# EAGLE design CICERONE AirLink (EAGLE 9.7.0)
COMPANY: https://github.com/atari-researchlab/cicerone-airlink; COPYRIGHT: Copyright (C) 2025 ATARI Research Lab; LICENSE: CERN-OHL-S-2.0+; PROJECT_NAME: CICERONE Airlink
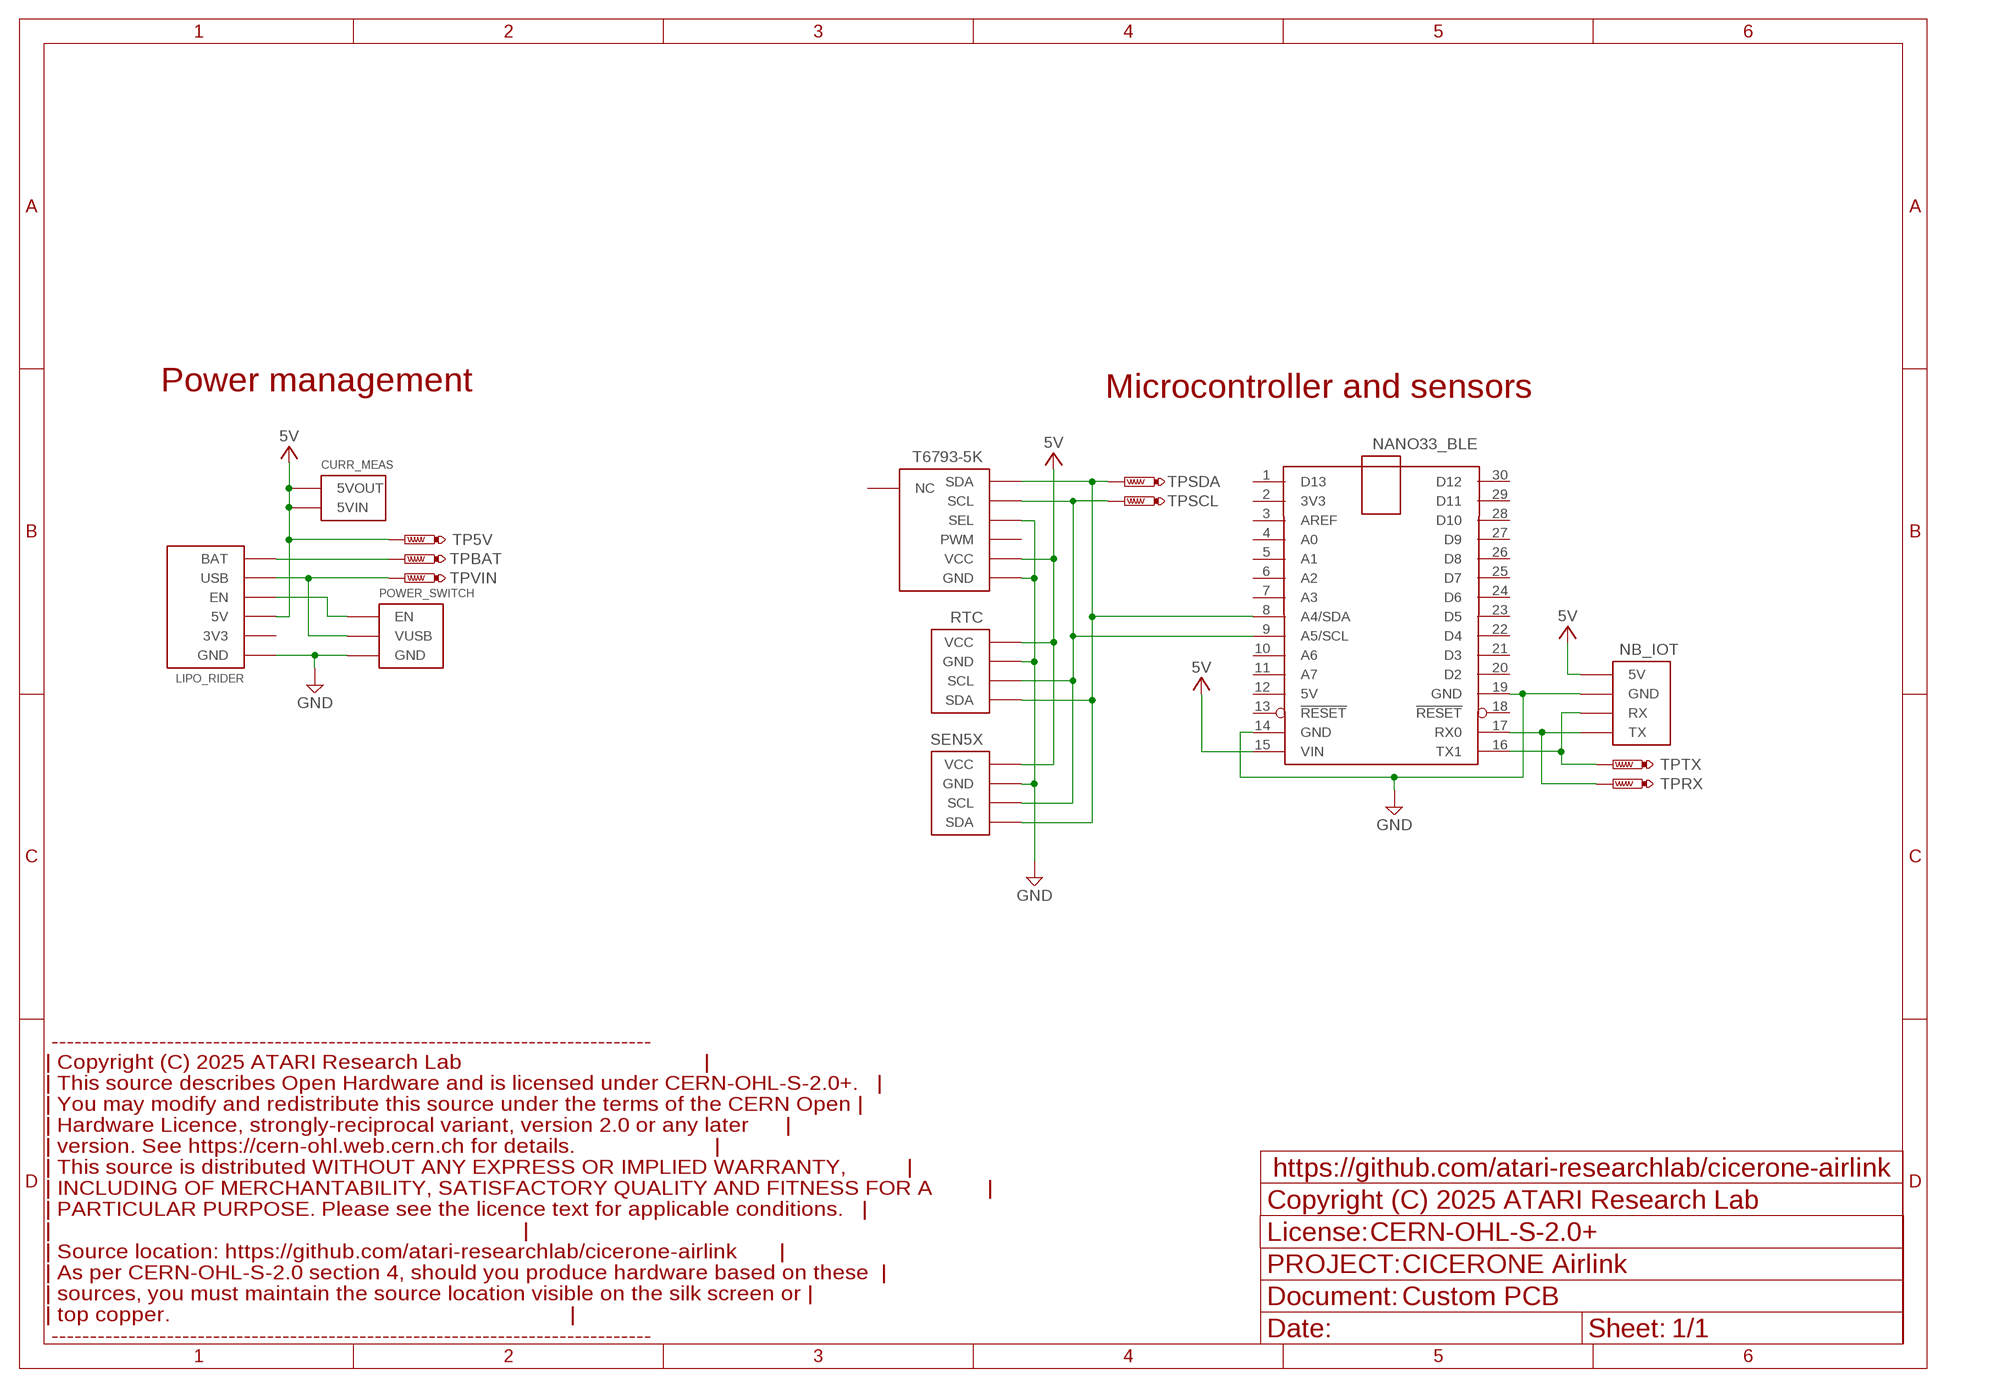
[diagram p0: schematic, sheet 1]

## Parts
CURR_MEAS  I→  CURR-MEAS  [PIN2X1]
LIPO_RIDER  LIPO-RIDER  [LIPO-RIDER-STAND]
NANO33_BLE  NANO33_BLEPIN  [NANO_BLE33_PIN]
NB_IOT  GROVE-UARTSMD  [GROVE_SMD]
POWER_SWITCH  USB_SWITCH  [USB-SWITCH]
RTC  MODULO_RTC  RTC-DS3231MMOD-90  [DS3231M-MOD-90]
SEN5X  I2C-HEADER  [I2C-HEADER]
T6793-5K  T6793  [T6793]
TP5V  PTR1TP20SQ  [TP20SQ]
TPBAT  PTR1TP20SQ  [TP20SQ]
TPRX  PTR1TP20SQ  [TP20SQ]
TPSCL  PTR1TP20SQ  [TP20SQ]
TPSDA  PTR1TP20SQ  [TP20SQ]
TPTX  PTR1TP20SQ  [TP20SQ]
TPVIN  PTR1TP20SQ  [TP20SQ]

## Nets
5V [PWR]: CURR_MEAS.P$1(5VOUT) CURR_MEAS.P$2(5VIN) LIPO_RIDER.P$4(5V) NANO33_BLE.15(VIN) NB_IOT.ROJ(5V) RTC.P$1(VCC) SEN5X.VCC T6793-5K.P$3(VCC) TP5V.TP
EN: LIPO_RIDER.P$2(EN) POWER_SWITCH.P$4(EN)
GND [GND]: LIPO_RIDER.P$3(GND) LIPO_RIDER.P$5(GND) LIPO_RIDER.P$7(GND) NANO33_BLE.14(GND) NANO33_BLE.19(GND) NB_IOT.NEG(GND) NB_IOT.P$1(GND) NB_IOT.P$2(GND) POWER_SWITCH.P$1(GND) RTC.P$2(GND) SEN5X.GND T6793-5K.P$4(GND) T6793-5K.P$6(SEL)
RX_ARDU: NANO33_BLE.17(RX0) NB_IOT.BLA(TX) TPRX.TP
SCL: NANO33_BLE.9(A5/SCL) RTC.P$3(SCL) SEN5X.SCL T6793-5K.P$2(SCL) TPSCL.TP
SDA: NANO33_BLE.8(A4/SDA) RTC.P$4(SDA) SEN5X.SDA T6793-5K.P$1(SDA) TPSDA.TP
TX_ARDU: NANO33_BLE.16(TX1) NB_IOT.AMA(RX) TPTX.TP
VBAT: LIPO_RIDER.P$6(BAT) TPBAT.TP
VUSB [PWR]: LIPO_RIDER.P$8(USB) POWER_SWITCH.P$2(VUSB) POWER_SWITCH.P$3(VUSB) TPVIN.TP
Unconnected: LIPO_RIDER.P$1(3V3) NANO33_BLE.1(D13) NANO33_BLE.2(3V3) NANO33_BLE.3(AREF) NANO33_BLE.4(A0) NANO33_BLE.5(A1) NANO33_BLE.6(A2) NANO33_BLE.7(A3) NANO33_BLE.10(A6) NANO33_BLE.11(A7) NANO33_BLE.12(5V) NANO33_BLE.13(!RESET) NANO33_BLE.18(!RESET) NANO33_BLE.20(D2) NANO33_BLE.21(D3) NANO33_BLE.22(D4) NANO33_BLE.23(D5) NANO33_BLE.24(D6) NANO33_BLE.25(D7) NANO33_BLE.26(D8) NANO33_BLE.27(D9) NANO33_BLE.28(D10) NANO33_BLE.29(D11) NANO33_BLE.30(D12) T6793-5K.P$5(PWM) T6793-5K.P$7(NC)

## Notes on the sheet
- Power management | Microcontroller and sensors
- ------------------------------------------------------------------------------
  | Copyright (C) 2025 ATARI Research Lab                                        |
  | This source describes Open Hardware and is licensed under CERN-OHL-S-2.0+.   |
  | You may modify and redistribute this source under the terms of the CERN Open |
  | Hardware Licence, strongly-reciprocal variant, version 2.0 or any later      |
  | version. See https://cern-ohl.web.cern.ch for details.                       |
  | This source is distributed WITHOUT ANY EXPRESS OR IMPLIED WARRANTY,          |
  | INCLUDING OF MERCHANTABILITY, SATISFACTORY QUALITY AND FITNESS FOR A         |
  | PARTICULAR PURPOSE. Please see the licence text for applicable conditions.   |
  |                                                                              |
  | Source location: https://github.com/atari-researchlab/cicerone-airlink       |
  | As per CERN-OHL-S-2.0 section 4, should you produce hardware based on these  |
  | sources, you must maintain the source location visible on the silk screen or |
  | top copper.                                                                  |
   ------------------------------------------------------------------------------

## Library data of the parts
CURR_MEAS = Custom Cicerone:CURR-MEAS
LIPO_RIDER = Custom Cicerone:LIPO-RIDER
NANO33_BLE = ArduinoNano:NANO33_BLE: Arduino Nano V3.0 Overview: The Arduino Nano is a small, complete, and breadboard-friendly board based on the ATmega328 (Arduino Nano 3.x) or ATmega168 (Arduino Nano 2.x). It has more or less the same functionality of the Arduino Duemilanove, but in a different package. It lacks only a DC power jack, and works with a Mini-B USB cable instead of a standard one. The Nano was designed and is being produced by Gravitech. Specifications: Microcontroller Atmel ATmega168 or ATmega328 Operating Voltage (logic level) 5 V Input Voltage (recommended) 7-12 V Input Voltage (limits) 6-20 V Digital I/O Pins 14 (of which 6 provide PWM output) Analog Input Pins 8 DC Current per I/O Pin 40 mA Flash Memory 16 KB (ATmega168) or 32 KB (ATmega328) of which 2 KB used by bootloader SRAM 1 KB (ATmega168) or 2 KB (ATmega328) EEPROM 512 bytes (ATmega168) or 1 KB (ATmega328) Clock Speed 16 MHz Dimensions 0.73" x 1.70" Length 45 mm Width 18 mm Weigth 5 g Power: The Arduino Nano can be powered via the Mini-B USB connection, 6-20V unregulated external power supply (pin 30), or 5V regulated external power supply (pin 27). The power source is automatically selected to the highest voltage source. Memory: The ATmega168 has 16 KB of flash memory for storing code (of which 2 KB is used for the bootloader); the ATmega328 has 32 KB, (also with 2 KB used for the bootloader). The ATmega168 has 1 KB of SRAM and 512 bytes of EEPROM (which can be read and written with the EEPROM library); the ATmega328 has 2 KB of SRAM and 1 KB of EEPROM. Input and Output: Each of the 14 digital pins on the Nano can be used as an input or output, using pinMode(), digitalWrite(), and digitalRead() functions. They operate at 5 volts. Each pin can provide or receive a maximum of 40 mA and has an internal pull-up resistor (disconnected by default) of 20-50 kOhms. In addition, some pins have specialized functions. Visit Arduino - ArduinoBoardNano <https://www.arduino.cc/en/Main/ArduinoBoardNano>
NB_IOT = Custom Cicerone:GROVE-UART
POWER_SWITCH = Custom Cicerone:USB_SWITCH
RTC = Custom Cicerone:RTC-DS3231M
SEN5X = Custom Cicerone:I2C-HEADER
T6793-5K = Custom Cicerone:T6793
TP5V TPBAT TPRX TPSCL TPSDA TPTX TPVIN = testpad:PTR1: TEST PIN

## Net classes
0 default: width 1 mm
1 PWR: width 1.5 mm
2 GND: width 1 mm

## Board
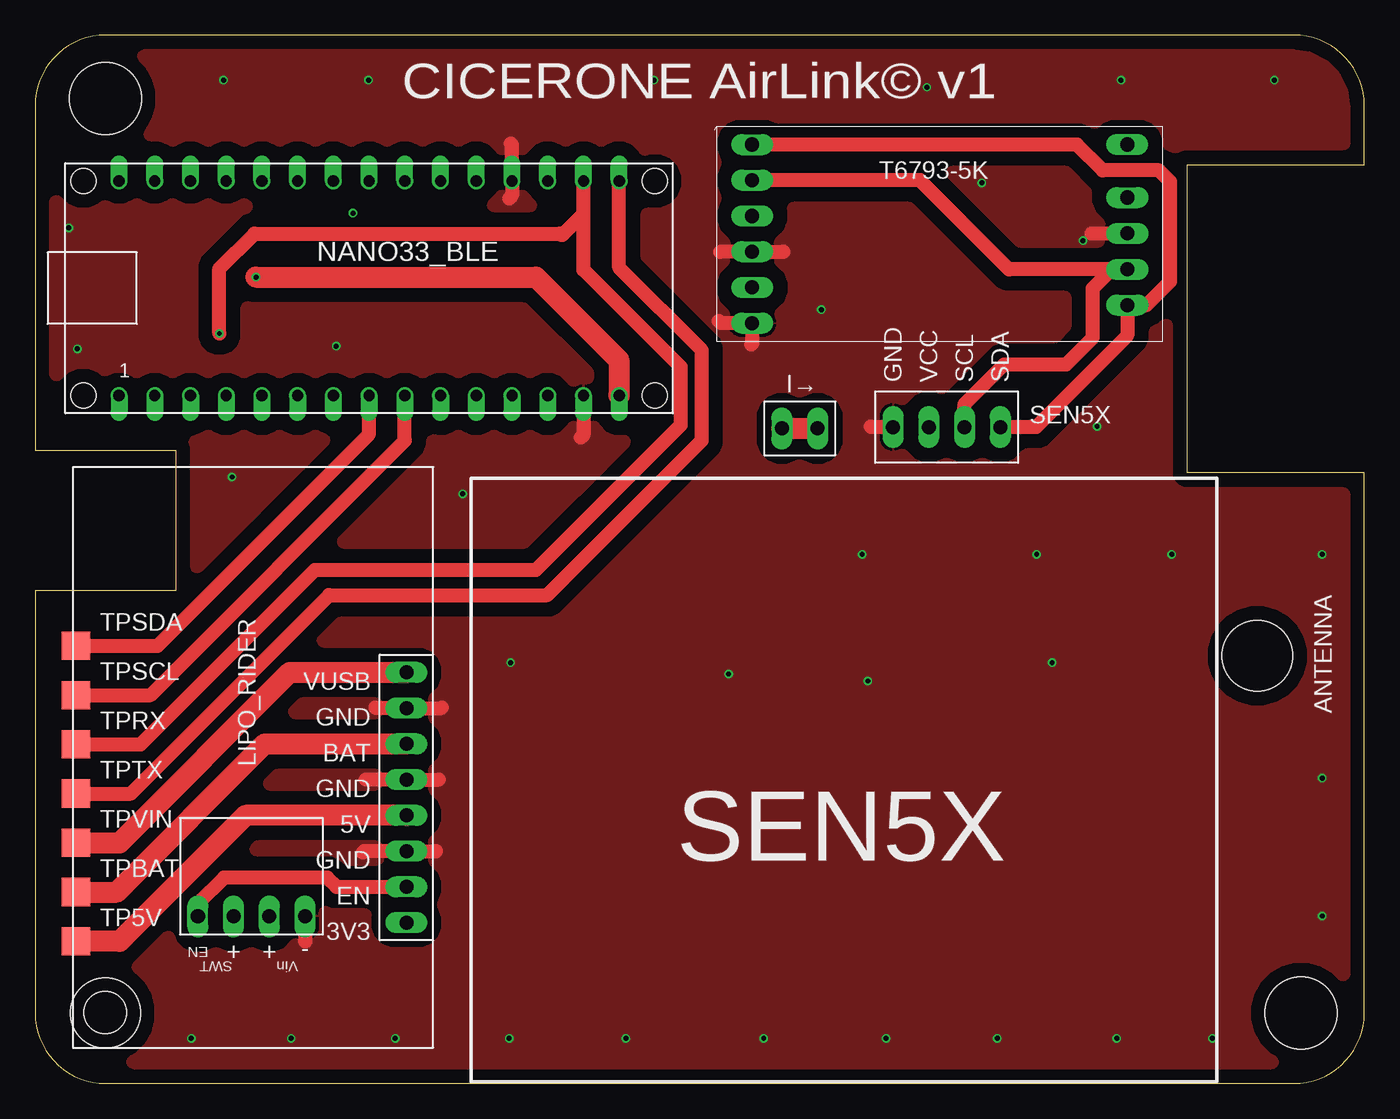
[diagram p1: board, top side]
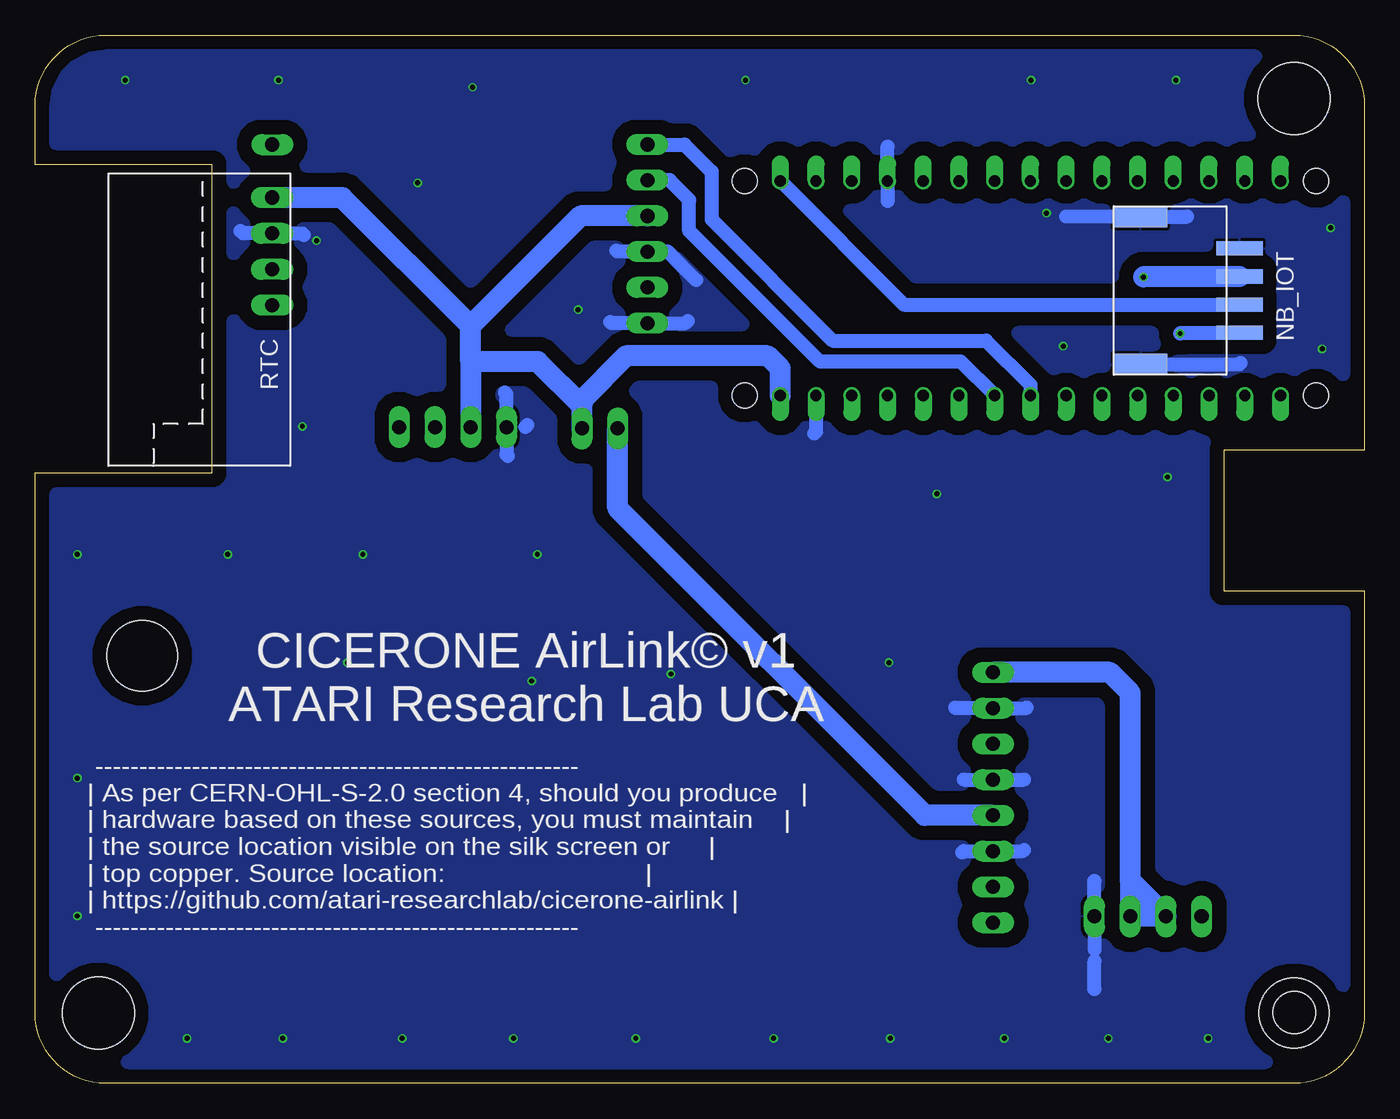
[diagram p2: board, bottom side, seen from below]

Size 94.5 x 74.5 mm. Coordinates in mm from the lower left corner, seen from the top.
Outline: 0,35 0,5 arc90 5,0 89.5,0 arc90 94.5,5 94.5,43.4 81.9,43.4 81.9,65.3 94.5,65.3 94.5,69.5 arc90 89.5,74.5 5,74.5 arc90 0,69.5 0,45 10,45 10,35 0,35
Copper layers (1*16): Top / Bottom
Stack-up Default Layer Stack: Top User Defined 0.018mm / Dielectric-1 User Defined 1.55mm / Bottom User Defined 0.018mm
Design rules: minimum copper width class=1 1.5mm, minimum copper width class=2 1mm, minimum copper width class=0 1mm, minimum copper width 0.15mm, minimum drill size 0.35mm, copper clearance wire_polygon to wire_polygon 0.15mm, copper clearance wire_polygon to pad_smd 0.15mm, copper clearance wire_polygon to via 0.15mm, copper clearance pad_smd to pad_smd 0.15mm, copper clearance pad_smd to via 0.15mm, copper clearance via to via 0.15mm, copper clearance smd to pad (same net) 0mil, copper clearance smd to via (same net) 0mil, copper clearance smd to smd (same net) 0mil, dimension clearance 0.25mm, via restrict clearance 0mil, restrict clearance 0mil, drill distance 0.35mm, keepout clearance 0mil
Holes 5.1 mm at 5,70 90,5
Holes 5 mm at 5,5 86.9,30.4
tKeepout: area 0,0 to 94.5,74.5; area 31,5 to 84,43
vRestrict: area 25.5,5 to 89.5,26.7

### Footprints (pad centres in the part's own frame; a part is rotated, then mirrored left to right if it is on the bottom)
PIN2X1 = drill 1 long: P$1 1.27,1.905; P$2 3.81,1.905
LIPO-RIDER-STAND = drill 1 long: P$1 8.89,1.905; P$2 11.43,1.905; P$3 13.97,1.905; P$4 16.51,1.905; P$5 19.05,1.905; P$6 21.59,1.905; P$7 24.13,1.905; P$8 26.67,1.905 | hole 3: 2.5,23.32
NANO_BLE33_PIN = drill 0.8 offset: 1 -20.32,-7.62; 2 -17.78,-7.62; 3 -15.24,-7.62; 4 -12.7,-7.62; 5 -10.16,-7.62; 6 -7.62,-7.62; 7 -5.08,-7.62; 8 -2.54,-7.62; 9 0,-7.62; 10 2.54,-7.62; 11 5.08,-7.62; 12 7.62,-7.62; 13 10.16,-7.62; 14 12.7,-7.62; 15 15.24,-7.62; 16 15.24,7.62; 17 12.7,7.62; 18 10.16,7.62; 19 7.62,7.62; 20 5.08,7.62; 21 2.54,7.62; 22 0,7.62; 23 -2.54,7.62; 24 -5.08,7.62; 25 -7.62,7.62; 26 -10.16,7.62; 27 -12.7,7.62; 28 -15.24,7.62; 29 -17.78,7.62; 30 -20.32,7.62 | hole 1.778: -22.86,-7.62; -22.86,7.62; 17.78,7.62; 17.78,-7.62
GROVE_SMD = smd 1 x 3.3: AMA 1,8.95; BLA 3,8.95; NEG -3,8.95; ROJ -1,8.95 | smd 1.5 x 3.8: P$1 -5.25,1.9; P$2 5.25,1.9
USB-SWITCH = drill 1 long: P$1 8.89,1.27; P$2 6.35,1.27; P$3 3.81,1.27; P$4 1.27,1.27
DS3231M-MOD-90 = drill 1 long: P$1 19.08,1.27; P$2 16.53,1.27; P$3 13.98,1.27; P$4 11.43,1.27
I2C-HEADER = drill 1 long: GND 8.89,2.54; SCL 3.81,2.54; SDA 1.27,2.54; VCC 6.35,2.54
T6793 = drill 1 long: P$1 1.27,2.54; P$2 3.81,2.54; P$3 6.35,2.54; P$4 8.89,2.54; P$5 11.43,2.54; P$6 13.97,2.54; P$7 1.27,29.21
TP20SQ = smd 2 x 2: TP 0,0

### Placement (x,y rotation side)
CURR_MEAS  56.9,48.45 180 top
LIPO_RIDER  28.3,2.54 90 top
NANO33_BLE  26.28,56.52 0 top
NB_IOT  17.82,56.35 270 bottom
POWER_SWITCH  10.3,10.6 0 top
RTC  76.38,43.88 90 bottom
SEN5X  69.89,49.19 180 top
T6793-5K  48.44,68 270 top
TP5V  2.9,10.1 0 top
TPBAT  2.9,13.6 0 top
TPRX  2.9,24.1 0 top
TPSCL  2.9,27.6 0 top
TPSDA  2.9,31.1 0 top
TPTX  2.9,20.6 0 top
TPVIN  2.9,17.1 0 top

### Tracks (layer width: path | path; a pad name or v marks a point on that pad's centre or on a via)
5V  (via drill 0.35)
  Top 1.5: v15.7,57.3 35.6,57.3 41.5,51.4 41.5,48.92 NANO33_BLE.15 | LIPO_RIDER.P$4 14.95,19.05 6,10.1 TP5V.TP | CURR_MEAS.P$2 CURR_MEAS.P$1
  Bottom 1.5: 63.54,51.3 SEN5X.VCC | 63.54,51.3 63.54,53.84 | 63.54,53.84 72.66,62.96 RTC.P$1 | T6793-5K.P$3 55.72,61.65 63.54,53.84 | 55.63,48.15 58.78,51.3 63.54,51.3 | NANO33_BLE.15 41.52,50.82 42.4,51.7 52.5,51.7 55.63,48.57 55.63,48.15 | LIPO_RIDER.P$4 31.25,19.05 53.09,40.89 CURR_MEAS.P$2 | NB_IOT.ROJ 15.65,57.35 v15.7,57.3 | CURR_MEAS.P$1 55.63,48.15
EN
  Top 1: POWER_SWITCH.P$4 11.57,12.77 13.42,14.62 20.77,14.62 21.42,13.97 LIPO_RIDER.P$2
GND  (via drill 0.35)
  Top 1: 39,48.92 NANO33_BLE.14 38.98,46.08 38.8,45.9 | 48.6,54.2 48.77,54.03 T6793-5K.P$6 50.98,52.58 50.9,52.5 | 48.7,59.1 50.97,59.1 T6793-5K.P$4 53.19,59.11 53.2,59.1 | SEN5X.GND 59.45,46.65 59.4,46.7 | 33.7,62.9 33.9,63.1 NANO33_BLE.19 33.9,66.7 33.8,66.8 | 24.2,26.7 24.23,26.67 LIPO_RIDER.P$7 28.87,26.67 28.9,26.7 | RTC.P$2 75.11,60.41 75.1,60.4 | 28.5,16.5 28.49,16.51 LIPO_RIDER.P$3 23.41,16.51 23.3,16.4 | 28.7,21.6 28.69,21.59 LIPO_RIDER.P$5 23.51,21.59 23.5,21.6 | POWER_SWITCH.P$1 19.19,10.11 19.2,10.1
  Bottom 1: 53.2,59.2 53.11,59.11 T6793-5K.P$4 49.51,59.11 47.5,57.1 | NANO33_BLE.14 38.98,46.32 39.1,46.2 | 59.65,46.65 59.5,46.8 | 60.9,44.6 61,44.7 SEN5X.GND 61,49 61.1,49.1 | 33.9,66.6 NANO33_BLE.19 33.9,62.7 | 28.5,21.6 28.49,21.59 LIPO_RIDER.P$5 24.21,21.59 24.2,21.6 | 24.2,16.6 24.29,16.51 LIPO_RIDER.P$3 28.49,16.51 28.6,16.4 | 19.19,8.7 19.19,6.71 19.2,6.7 | 29.1,26.7 29.07,26.67 LIPO_RIDER.P$7 24.03,26.67 24,26.7 | 75.4,60.3 75.51,60.41 RTC.P$2 79.71,60.41 79.9,60.6 | 19.2,14.4 19.19,14.39 POWER_SWITCH.P$1 19.19,9.5 | 48.1,54.2 48.27,54.03 T6793-5K.P$6 53.53,54.03 53.6,54.1 | NB_IOT.P$2 8.9,51.1 8.8,51.2 | 12.6,61.6 NB_IOT.P$1 21.2,61.6
  other vias: 30.4,41.9 11.1,3.2 75.5,46.7 63.4,70.8 55.9,55 22.6,61.85 2.4,60.8 3,52.2 21.4,52.4 67.3,64 74.5,59.9 18.2,3.2 25.6,3.2 33.7,3.2 42,3.2 51.8,3.2 60.5,3.2 68.4,3.2 76.9,3.2 83.7,3.2 91.5,11.9 91.5,21.7 91.5,37.6 13.4,71.3 23.7,71.3 44,71.3 77.2,71.3 88.1,71.3 49.3,29.1 58.8,37.6 59.2,28.6 71.2,37.6 72.3,29.9 80.8,37.6 14,43.1 33.8,29.9
  pour Bottom (isolate 1.016): -1,75 95,75 95,-1 -1,-1
  pour Top (isolate 1.016): -0.5,75.5 95.5,75.5 95.5,-0.5 -0.5,-0.5
RX_ARDU  (via drill 0.35)
  Top 1: 38.98,61.8 38.98,57.82 45.9,50.9 45.9,46.8 35.6,36.5 19.9,36.5 7.5,24.1 TPRX.TP | 38.98,61.8 NANO33_BLE.17 | v13.1,53.3 13.1,57.9 15.6,60.4 37.3,60.4 37.4,60.3 37.48,60.3 38.98,61.8
  Bottom 1: NB_IOT.BLA 13.05,53.35 v13.1,53.3
SCL
  Top 1: SEN5X.SCL 66.08,48.28 68.9,51.1 73.3,51.1 75.2,53 75.2,56.5 76.56,57.86 RTC.P$3 69.24,57.86 62.91,64.19 T6793-5K.P$2 | TPSCL.TP 8.2,27.6 26.28,45.68 NANO33_BLE.9
  Bottom 1: NANO33_BLE.9 28.68,51.3 38.7,51.3 48,60.6 48,62.8 49.39,64.19 T6793-5K.P$2
SDA
  Top 1: SEN5X.SDA 71.15,46.65 77.65,53.15 RTC.P$4 79.01,55.31 80.7,57 80.7,64.1 79.9,64.9 75.9,64.9 74.07,66.73 T6793-5K.P$1 | TPSDA.TP 8.7,31.1 23.74,46.14 NANO33_BLE.8
  Bottom 1: T6793-5K.P$1 48.33,66.73 46.4,64.8 46.4,61.4 37.8,52.8 26.9,52.8 23.74,49.64 NANO33_BLE.8
TX_ARDU
  Top 1: NANO33_BLE.16 41.52,57.98 47.4,52.1 47.4,45.7 36.4,34.7 20.9,34.7 6.8,20.6 TPTX.TP
  Bottom 1: NANO33_BLE.16 32.73,55.35 NB_IOT.AMA
VBAT
  Top 1.5: TPBAT.TP 5.8,13.6 16.33,24.13 LIPO_RIDER.P$6
VUSB
  Top 1.5: LIPO_RIDER.P$8 18.11,29.21 6,17.1 TPVIN.TP
  Bottom 1.5: 16.65,14.41 16.65,27.75 18.11,29.21 LIPO_RIDER.P$8 | 16.65,14.41 POWER_SWITCH.P$2 POWER_SWITCH.P$3 16.65,14.41

### Text on the board
tNames: CICERONE AirLink© v1 | ANTENNA | SEN5X
bNames: CICERONE AirLink© v1 / ATARI Research Lab UCA | ------------------------------------------------------- / | As per CERN-OHL-S-2.0 section 4, should you produce | / | hardware based on these sources, you must maintain | / | the source location visible on the silk screen or | / | top copper. Source location: | / | https://github.com/atari-researchlab/cicerone-airlink | / -------------------------------------------------------